# Altium schematic sheet Supply.SchDoc
size A4; Organization: ArSilicii s.r.l.; Address1: Via Sardegna, 11; Address2: 53036 Poggibonsi (SI)  - ITALY -; Address3: e-mail : ArSilicii@ArSilicii.com; SheetNumber: 0; SheetTotal: 0
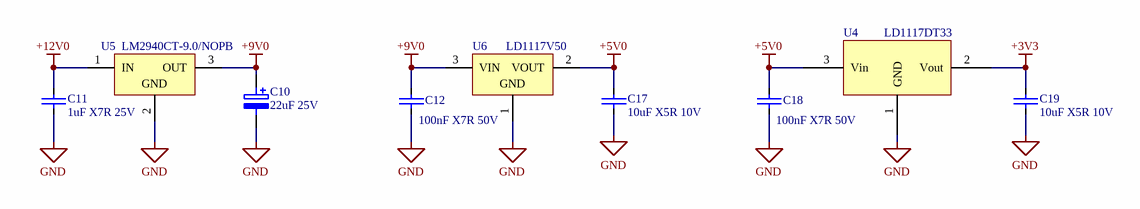
[diagram p0: Supply.SchDoc]

## Parts
C10  22uF 25V  [TANT_D]
C11  1uF X7R 25V  [0805]
C12  100nF X7R 50V  [0805]
C17  10uF X5R 10V  [0805]
C18  100nF X7R 50V  [0805]
C19  10uF X5R 10V  [0805]
U4  LD1117DT33  [TO-252-7805]
U5  LM2940CT-9.0/NOPB  [NDE0003A]
U6  LD1117V50  [TO220]

## Nets
+3V3: C19.1 U4.2(Vout)
+5V0: C17.1 C18.1 U4.3(Vin) U6.2(VOUT)
+9V0: C10.1 C12.1 U5.3(OUT) U6.3(VIN)
+12V0: C11.1 U5.1(IN)
GND: C10.2 C11.2 C12.2 C17.2 C18.2 C19.2 U4.1(GND) U5.2(GND) U6.1(GND)

## Notes on the sheet
- Title :
- Size:
- Date:
- A4
- Version:
- Sheet
- of
- Designer:
- Revisor:

## Library data of the parts
C10 = CAP_TANT_22uF 25V Case D: Capacità polarizzata; ArSilicii Part Number: CPC0352022; Manufacturer: Kemet; Manufacturer Part Number: T491D226K025AT; SMD/TH: SMD; 1 Supplier: DISTAR S.R.L.; 1 Supplier Part Number: KETT491D226K025AT; 1 Supplier Unit Price: 0,060; 2 Supplier: ABACUS ECC S.R.L. - UNIPERSONALE; 2 Supplier Part Number: KETT491D226K025AT; 2 Supplier Unit Price: *; 3 Supplier: ARROW ELECTRONICS ITALIA S.R.L.; 3 Supplier Part Number: KETT491D226K025AT; 3 Supplier Unit Price: *; ComponentLink1URL: *; ComponentLink2URL: *; ComponentLink1Description: *; ComponentLink2Description: *; HelpURL: *
C11 = CAP_1uF X7R 25V_0805: Capacità; ArSilicii Part Number: CPC0212002; Manufacturer: Samsung; Manufacturer Part Number: CL21B105KAFNNNG; SMD/TH: SMD; 1 Supplier: AVNET EMG ITALY S.R.L.; 1 Supplier Part Number: CL21B105KAFNNNG; 1 Supplier Unit Price: *; 2 Supplier: *; 2 Supplier Part Number: *; 2 Supplier Unit Price: *; 3 Supplier: *; 3 Supplier Part Number: *; 3 Supplier Unit Price: *; ComponentLink1URL: *; ComponentLink2URL: *; ComponentLink1Description: *; ComponentLink2Description: *; HelpURL: *
C12 C18 = CAP_100nF X7R 50V_0805: Capacità; ArSilicii Part Number: CPC0213100; Manufacturer: Kemet; Manufacturer Part Number: C0805C104K5RAC7800; SMD/TH: SMD; 1 Supplier: ARROW ELECTRONICS ITALIA S.R.L.; 1 Supplier Part Number: C0805C104K5RAC7800; 1 Supplier Unit Price: 0,00240; 2 Supplier: AVNET EMG ITALY S.R.L.; 2 Supplier Part Number: 08055C104KAT2A AVX; 2 Supplier Unit Price: *; 3 Supplier: *; 3 Supplier Part Number: *; 3 Supplier Unit Price: *; ComponentLink1URL: *; ComponentLink2URL: *; ComponentLink1Description: *; ComponentLink2Description: *; HelpURL: *
C17 C19 = CAP_10uF X5R 10V_0805: Capacità; ArSilicii Part Number: CPC0212010; Manufacturer: Samsung; Manufacturer Part Number: CL21A106KPFNNNE; SMD/TH: SMD; 1 Supplier: ARROW ELECTRONICS ITALIA S.R.L.; 1 Supplier Part Number: CL21A106KPFNNNE; 1 Supplier Unit Price: *; 2 Supplier: *; 2 Supplier Part Number: *; 2 Supplier Unit Price: *; 3 Supplier: *; 3 Supplier Part Number: *; 3 Supplier Unit Price: *; ComponentLink1URL: *; ComponentLink2URL: *; ComponentLink1Description: *; ComponentLink2Description: *; HelpURL: \\Sorp\articoli\CPC0212010\F3102_CerPerChar.pdf
U4 = LD1117DT33: Regolatore Low Dropout; ArSilicii Part Number: IC01000010; Manufacturer: ST; SMD/TH: SMD; 1 Supplier: HT COMPONENTI ELETTRONICI S.R.L.; 1 Supplier Part Number: LD1117DT33TR TO252-3; 1 Supplier Unit Price: 0,105; 2 Supplier: EBV ELEKTRONIK S.R.L.; 2 Supplier Part Number: *; 2 Supplier Unit Price: *; 3 Supplier: *; 3 Supplier Part Number: *; 3 Supplier Unit Price: *; Manufacturer Part Number: LD1117DT33; ComponentLink1URL: http://www.st.com/st-web-ui/static/active/en/resource/technical/document/datasheet/CD00000544.pdf; ComponentLink2URL: *; ComponentLink1Description: Datasheet for LD1117DT33; ComponentLink2Description: *; HelpURL: D:\Documenti ArSilicii\DataSheet\Regolatori\LD1117.pdf
U5 = CMP-0062-02531-3: 1A Low Dropout Regulator, 3-pin TO-220, Pb-Free; Manufacturer: Texas Instruments; CompType: LDO IC; PowerWise: N; PackageTopMarking: NSUZXYTTE#*LM2940CT*-9.0 P+; PackageDescription: TO-220, Molded, 3 Lead, Straight; PackageReference: NDE0003A; PinCount: 3; ComponentLink1URL: http://www.ti.com/general/docs/lit/getliterature.tsp?genericPartNumber=LM2940C&fileType=pdf; ComponentLink1Description: Datasheet URL; RoHS: Y
U6 = CMP-0244-00472-1: Fixed Low Drop Positive Voltage Regulator, 5V, 3-Pin TO-220; ComponentLink1URL: http://www.st.com; ComponentLink1Description: Manufacturer URL; DatasheetVersion: 1/11/2011; PackageDescription: TO, Thru-Hole, Vertical, Heatsink Mounted; 3 In-Line Leads; Pitch 2.54 mm; ComponentLink2Description: Datasheet; ComponentLink3URL: http://www.st.com/internet/com/TECHNICAL_RESOURCES/TECHNICAL_LITERATURE/PACKAGE_INFORMATION/CD00004649.pdf; PackageVersion: ver3.0; PackageReference: TO220; ComponentLink2URL: http://www.st.com/internet/com/TECHNICAL_RESOURCES/TECHNICAL_LITERATURE/DATASHEET/CD00000544.pdf; ComponentLink3Description: Package Specification